# Altium schematic sheet MotorDriver_BrushedMotor_Communication.SchDoc
size A; SheetNumber: 4; SheetTotal: 4
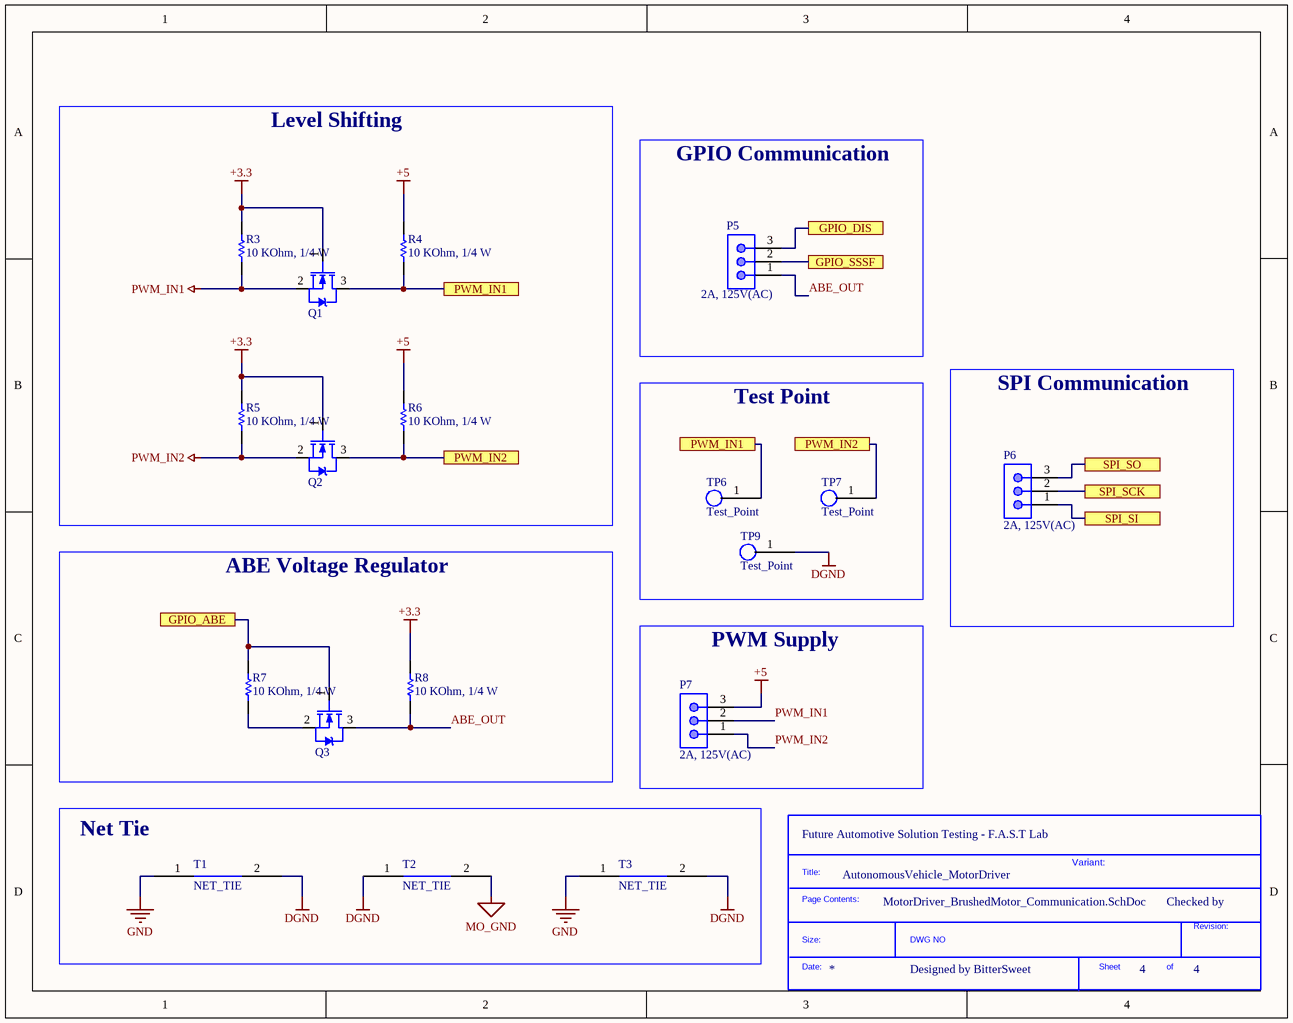
[diagram p0: MotorDriver_BrushedMotor_Communication.SchDoc]

## Parts
*?  SDTitleBlock  (value not drawn)  (graphical)
P5  2A, 125V(AC)  [620103131822]
P6  2A, 125V(AC)  [620103131822]
P7  2A, 125V(AC)  [620103131822]
Q1  Mosfet_N_channel  [MOSFET_N_SOT23-3]  (value not drawn)
Q2  Mosfet_N_channel  [MOSFET_N_SOT23-3]  (value not drawn)
Q3  Mosfet_N_channel  [MOSFET_N_SOT23-3]  (value not drawn)
R3  10 KOhm, 1/4 W  [resistor_0603]
R4  10 KOhm, 1/4 W  [resistor_0603]
R5  10 KOhm, 1/4 W  [resistor_0603]
R6  10 KOhm, 1/4 W  [resistor_0603]
R7  10 KOhm, 1/4 W  [resistor_0603]
R8  10 KOhm, 1/4 W  [resistor_0603]
T1  NET_TIE  [NET_TIE_2.0mm]
T2  NET_TIE  [NET_TIE_2.0mm]
T3  NET_TIE  [NET_TIE_2.0mm]
TP6  Test_Point  [TP_1_5mm_SMD]
TP7  Test_Point  [TP_1_5mm_SMD]
TP9  Test_Point  [TP_1_5mm_SMD]

## Blocks framed on the sheet
Level Shifting: Q1 Q2 R3-R6
GPIO Communication: P5
Test Point: TP6 TP7 TP9
SPI Communication: P6
ABE Voltage Regulator: Q3 R7 R8
PWM Supply: P7
Net Tie: T1-T3

## Ports
GPIO_ABE, GPIO_DIS, GPIO_SSSF, PWM_IN1, PWM_IN2, SPI_SCK, SPI_SI, SPI_SO

## Nets
+3.3: Q1.1(G) Q2.1(G) R3.1 R5.1 R8.1
+5: P7.3 R4.1 R6.1
DGND: T1.2 T2.1 T3.2 TP9.1
GND: T1.1 T3.1
MO_GND: T2.2
PWM_IN1: P7.2 Q1.2(S) R3.2
PWM_IN2: P7.1 Q2.2(S) R5.2
ABE_OUT: P5.1 Q3.3(D) R8.2
GPIO_ABE: Q3.1(G) R7.1 ; port GPIO_ABE
GPIO_DIS: P5.3 ; port GPIO_DIS
GPIO_SSSF: P5.2 ; port GPIO_SSSF
PWM_IN1: Q1.3(D) R4.2 TP6.1 ; port PWM_IN1  [a separate net that carries the same name]
PWM_IN2: Q2.3(D) R6.2 TP7.1 ; port PWM_IN2  [a separate net that carries the same name]
SPI_SCK: P6.2 ; port SPI_SCK
SPI_SI: P6.1 ; port SPI_SI
SPI_SO: P6.3 ; port SPI_SO
NetQ3_2: Q3.2(S) R7.2

## Notes on the sheet
- (near *?) Future Automotive Solution Testing - F.A.S.T Lab
- AutonomousVehicle_MotorDriver
- Variant:
- Checked by
- Designed by BitterSweet
- (in symbol SDTitleBlock) Title:; Page Contents:; Revision:; Size:; DWG NO; Date:; Sheet; of

## Library data of the parts
P5-P7 = 620103131822: WR-WTB SMT Male Horizontal Shrouded Header, pitch 2mm, 3p; Pin Number: 3; Contact Resistance: 20mOhm; Withstanding Voltage: 800VAC; Working Voltage: 100VAC; ComponentLink1Description: Manufacturer; ComponentLink1URL: http://www.we-online.de; ComponentLink2Description: Datasheet; ComponentLink2URL: https://www.we-online.com/catalog/datasheet/620103131822.pdf; Pitch: 2mm; Published Date: January 2020; Publisher: Wurth Elektronik; Mounting Technology: SMT; Packaging: Tape and Reel; Operating Temperature: -25 to +85degC; Part Number: 620103131822; Gender: Male; Type: Horizontal; Rated Current: 2A; ComponentLink3Description: Global Supply; ComponentLink3URL: https://www.we-online.com/en/components/products/WTB_2_00_SMT_MALE_HORIZONTAL_SHROUDED_HEADER_6201XX131822?sq=620103131822#620103131822; ComponentLink4Description: Global Supply; ComponentLink4URL: https://www.mouser.vn/ProductDetail/Wurth-Elektronik/620103131822?qs=ZtY9WdtwX54jBicvPVEzcw%3D%3D; Supplier 1 Name: Mouser; Supplier 1 SN: 710-620103131822; Supplier 1 URL: https://www.mouser.vn/ProductDetail/Wurth-Elektronik/620103131822?qs=ZtY9WdtwX54jBicvPVEzcw%3D%3D; Supplier 2 Name: Digi-Key; Supplier 2 SN: N/A; Supplier 2 URL: N/A; Supplier 3 Name: thegioiic; Supplier 3 SN: N/A; Supplier 3 URL: N/A; Value: 2A, 125V(AC)
R3-R8 = 0006031031: RES, size 0603, 10 KOhm, 1/4 W; Manufacture  Name: OEM; Resistance: 10 KOhm; Rated Power: 1/4 W; Resistance Tolerance: +/-1%; Size: 0603; Mounting Technology: SMT; Supplier 1 Name: Mouser; Supplier 1 SN: 755-ESR03EZPF1002; Supplier 2 Name: Digi-Key; Supplier 2 SN: RHM10KADTR-ND RHM10KADCT-ND RHM10KADDKR-ND; Supplier 1 URL: https://www.mouser.vn/ProductDetail/ROHM-Semiconductor/ESR03EZPF1002?qs=sGAEpiMZZMvdGkrng054t67Efho1F8r6CDeAsqwFse8%3D; Supplier 3 Name: thegioiic; Supplier 3 SN: N/A; Supplier 3 URL: N/A; Manufacture  SN: OEM; Value: 10 KOhm, 1/4 W; ComponentLink1Description: Datasheet link; ComponentLink1URL: https://fscdn.rohm.com/en/products/databook/datasheet/passive/resistor/chip_resistor/esr-e.pdf; ComponentLink2Description: Supplier 1 URL; ComponentLink2URL: https://www.thegioiic.com/dien-tro-10-kohm-0603-1-; ComponentLink3Description: Supplier 2 URL; ComponentLink3URL: https://www.digikey.com/en/products/detail/rohm-semiconductor/ESR03EZPF1002/1983429; ComponentLink4Description: Supplier 3 URL; ComponentLink4URL: N/A; Supplier 2 URL: https://www.digikey.com/en/products/detail/rohm-semiconductor/ESR03EZPF1002/1983429; JLCPCB Part: C2087321; Parameter 1: *; ComponentLink5Description: JLCPCB Link; ComponentLink5URL: https://jlcpcb.com/partdetail/Yageo-RT0603BRD1010KL/C2087321
T1-T3 = NET_TIE: Straight Net Tie
Q1-Q3 = Mosfet_N_channel: JLCPCB Part: C22367238; ComponentLink1Description: JLCPCB Link; ComponentLink1URL: https://jlcpcb.com/partdetail/HXYMOSFET-Si2300DS_T1_GE3HXY/C22367238